# Altium schematic sheet Adapters.SchDoc: various
size 420 x 297 mm; Author: G.Kasprowicz; CompanyName: WUT ISE; DrawnBy: G.Kasprowicz; Organization: WUT ISE; Address1: PW ISE; Address2: Nowowiejska 15/19 00-665 Warsaw; Address3: gkasprow@gmail.com; DocumentNumber: 4; Revision: 2; SheetNumber: 4; SheetTotal: 8; ModifiedBy: -; CheckedDate: -; Title2: adapters; DivGrp: WUT ISE; Designer: G.Kasprowicz; ModifiedDate: -; ProjectName: Sensor Box
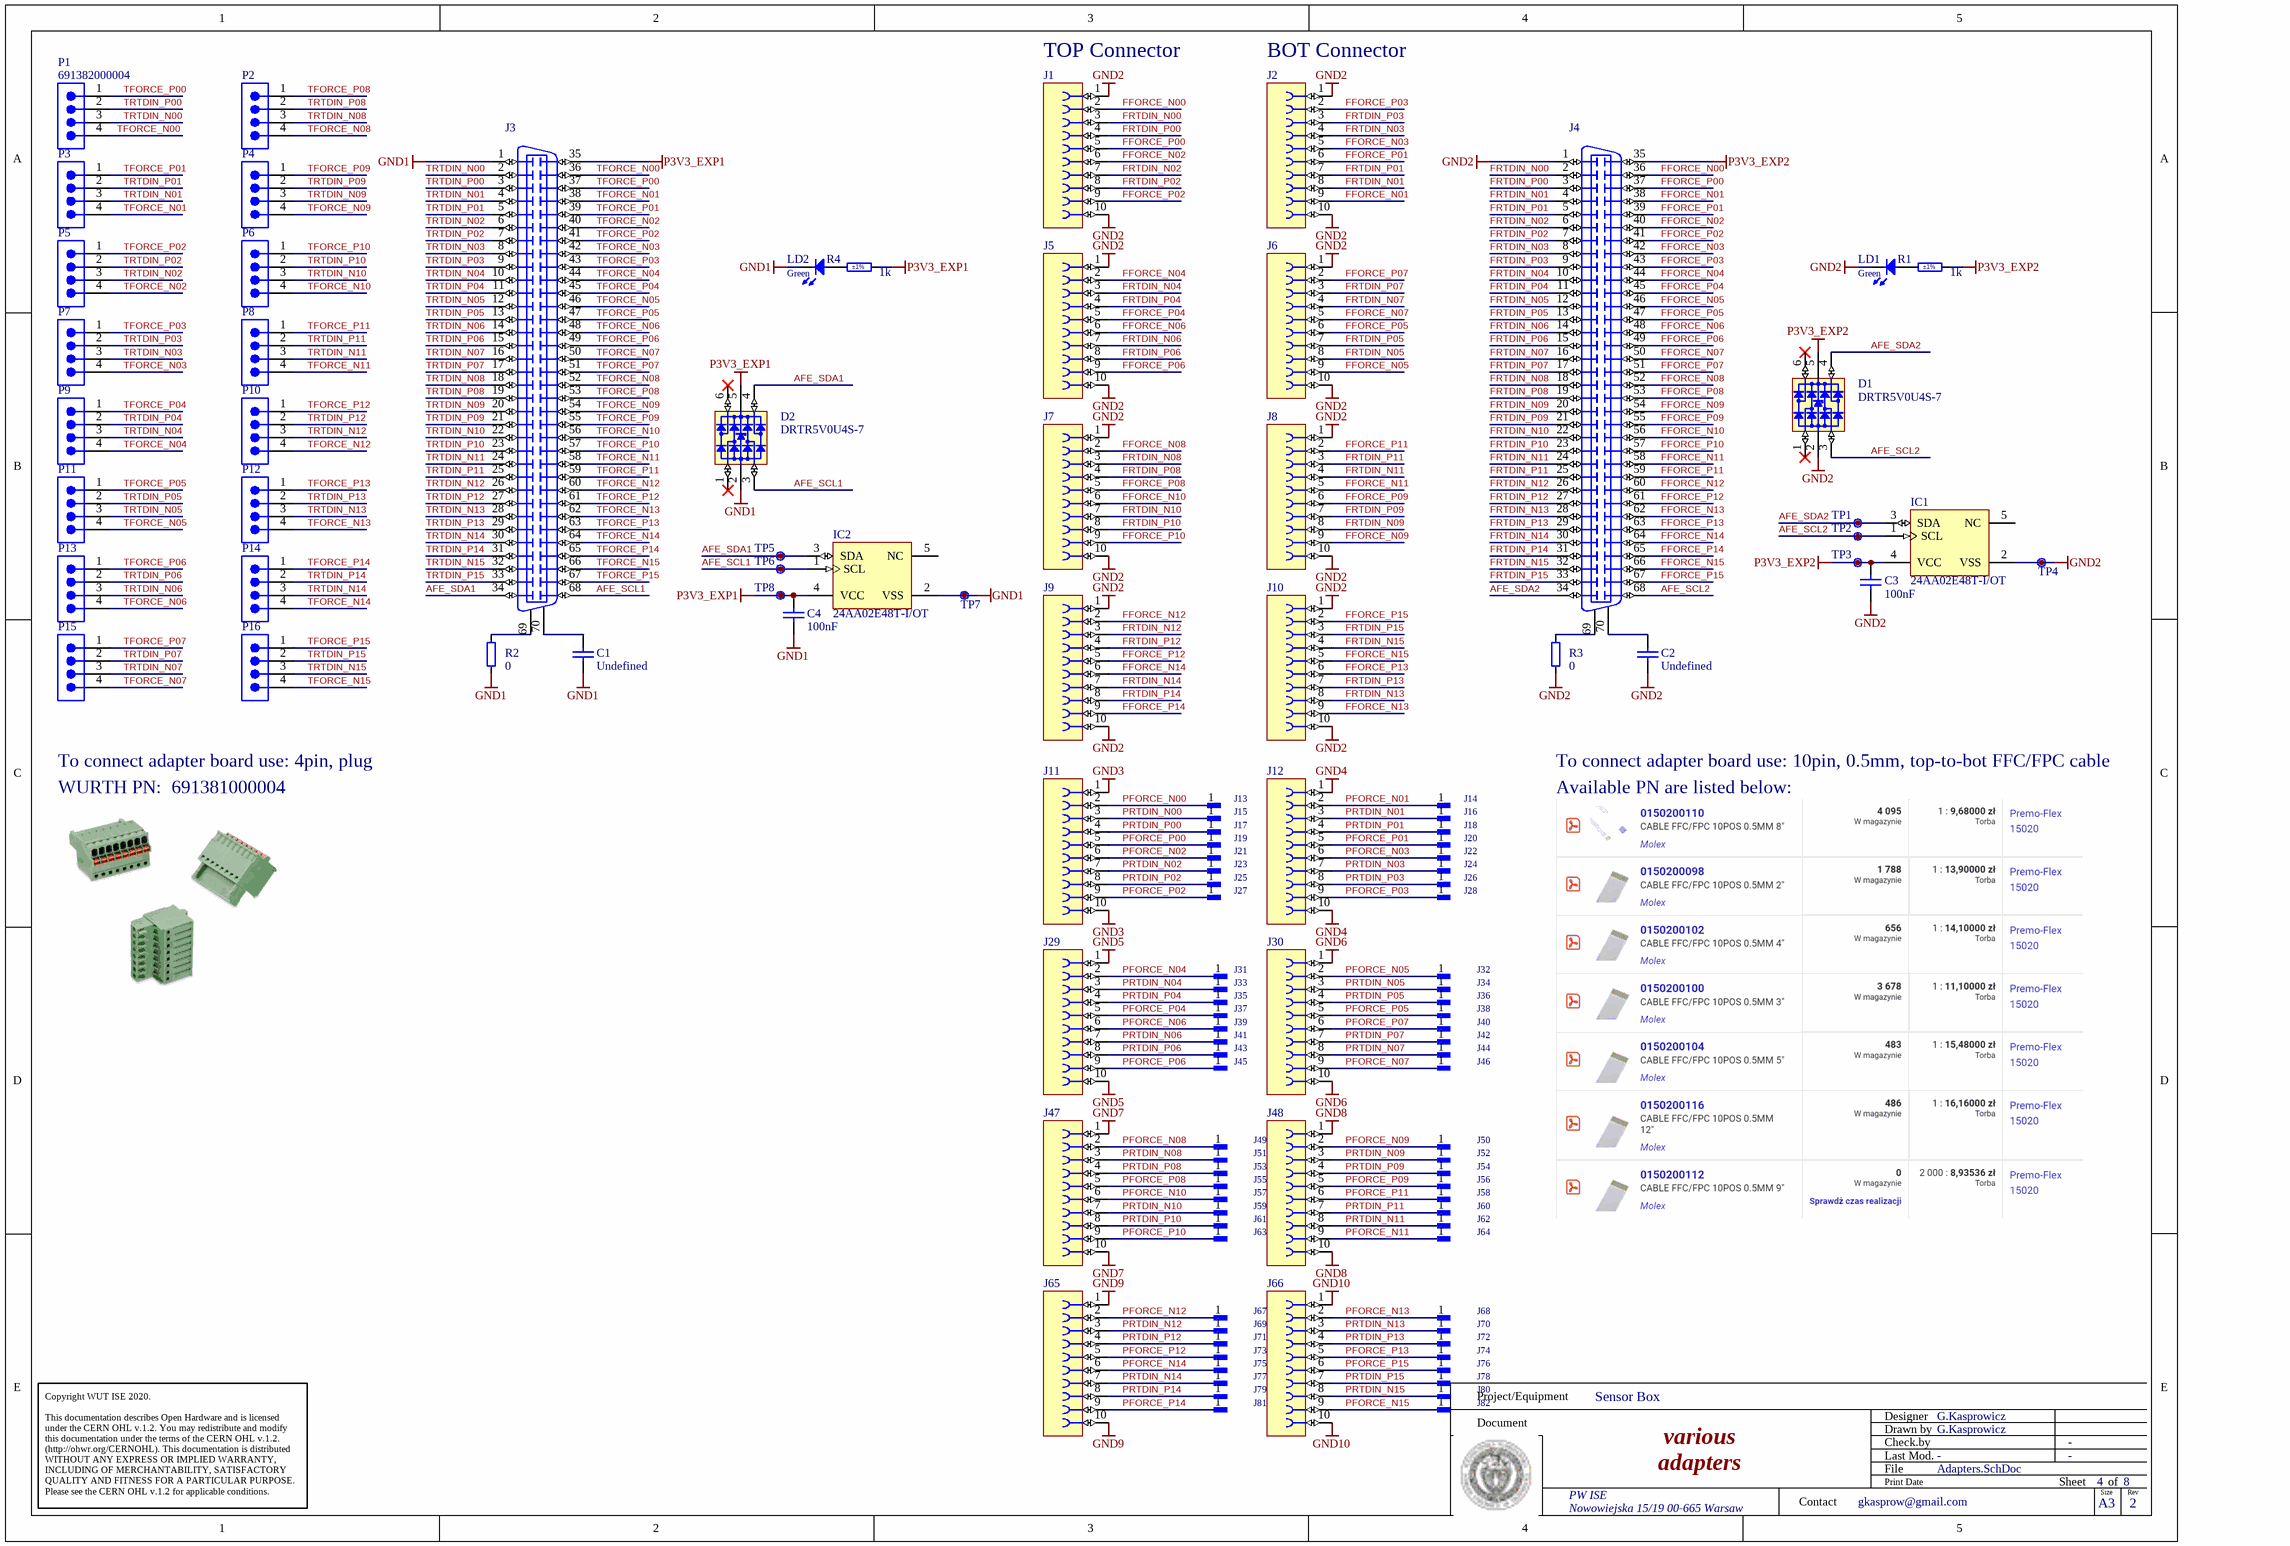
[diagram p0: Adapters.SchDoc]

## Parts
C1  Undefined  [CAPC2012X135N]
C2  Undefined  [CAPC2012X135N]
C3  100nF  [CAPC1608X87N]
C4  100nF  [CAPC1608X87N]
D1  DRTR5V0U4S-7  [SOT65P210X110-6N]
D2  DRTR5V0U4S-7  [SOT65P210X110-6N]
IC1  24AA02E48T-I/OT  [SOT95P280X145-5N]
IC2  24AA02E48T-I/OT  [SOT95P280X145-5N]
J1  FFC/FPC  [MOLEX_52745-1097]  (value not drawn)
J2  FFC/FPC  [MOLEX_52745-1097]  (value not drawn)
J3  DNP  [MOLEX_71430-0013]  (value not drawn)
J4  DNP  [MOLEX_71430-0013]  (value not drawn)
J5  FFC/FPC  [MOLEX_52745-1097]  (value not drawn)
J6  FFC/FPC  [MOLEX_52745-1097]  (value not drawn)
J7  FFC/FPC  [MOLEX_52745-1097]  (value not drawn)
J8  FFC/FPC  [MOLEX_52745-1097]  (value not drawn)
J9  FFC/FPC  [MOLEX_52745-1097]  (value not drawn)
J10  FFC/FPC  [MOLEX_52745-1097]  (value not drawn)
J11  FFC/FPC  [MOLEX_52745-1097]  (value not drawn)
J12  FFC/FPC  [MOLEX_52745-1097]  (value not drawn)
J13  SMD Pad  [R350X200]  (value not drawn)  (net tie, no BOM)
J14  SMD Pad  [R350X200]  (value not drawn)  (net tie, no BOM)
J15  SMD Pad  [R350X200]  (value not drawn)  (net tie, no BOM)
J16  SMD Pad  [R350X200]  (value not drawn)  (net tie, no BOM)
J17  SMD Pad  [R350X200]  (value not drawn)  (net tie, no BOM)
J18  SMD Pad  [R350X200]  (value not drawn)  (net tie, no BOM)
J19  SMD Pad  [R350X200]  (value not drawn)  (net tie, no BOM)
J20  SMD Pad  [R350X200]  (value not drawn)  (net tie, no BOM)
J21  SMD Pad  [R350X200]  (value not drawn)  (net tie, no BOM)
J22  SMD Pad  [R350X200]  (value not drawn)  (net tie, no BOM)
J23  SMD Pad  [R350X200]  (value not drawn)  (net tie, no BOM)
J24  SMD Pad  [R350X200]  (value not drawn)  (net tie, no BOM)
J25  SMD Pad  [R350X200]  (value not drawn)  (net tie, no BOM)
J26  SMD Pad  [R350X200]  (value not drawn)  (net tie, no BOM)
J27  SMD Pad  [R350X200]  (value not drawn)  (net tie, no BOM)
J28  SMD Pad  [R350X200]  (value not drawn)  (net tie, no BOM)
J29  FFC/FPC  [MOLEX_52745-1097]  (value not drawn)
J30  FFC/FPC  [MOLEX_52745-1097]  (value not drawn)
J31  SMD Pad  [R350X200]  (value not drawn)  (net tie, no BOM)
J32  SMD Pad  [R350X200]  (value not drawn)  (net tie, no BOM)
J33  SMD Pad  [R350X200]  (value not drawn)  (net tie, no BOM)
J34  SMD Pad  [R350X200]  (value not drawn)  (net tie, no BOM)
J35  SMD Pad  [R350X200]  (value not drawn)  (net tie, no BOM)
J36  SMD Pad  [R350X200]  (value not drawn)  (net tie, no BOM)
J37  SMD Pad  [R350X200]  (value not drawn)  (net tie, no BOM)
J38  SMD Pad  [R350X200]  (value not drawn)  (net tie, no BOM)
J39  SMD Pad  [R350X200]  (value not drawn)  (net tie, no BOM)
J40  SMD Pad  [R350X200]  (value not drawn)  (net tie, no BOM)
J41  SMD Pad  [R350X200]  (value not drawn)  (net tie, no BOM)
J42  SMD Pad  [R350X200]  (value not drawn)  (net tie, no BOM)
J43  SMD Pad  [R350X200]  (value not drawn)  (net tie, no BOM)
J44  SMD Pad  [R350X200]  (value not drawn)  (net tie, no BOM)
J45  SMD Pad  [R350X200]  (value not drawn)  (net tie, no BOM)
J46  SMD Pad  [R350X200]  (value not drawn)  (net tie, no BOM)
J47  FFC/FPC  [MOLEX_52745-1097]  (value not drawn)
J48  FFC/FPC  [MOLEX_52745-1097]  (value not drawn)
J49  SMD Pad  [R350X200]  (value not drawn)  (net tie, no BOM)
J50  SMD Pad  [R350X200]  (value not drawn)  (net tie, no BOM)
J51  SMD Pad  [R350X200]  (value not drawn)  (net tie, no BOM)
J52  SMD Pad  [R350X200]  (value not drawn)  (net tie, no BOM)
J53  SMD Pad  [R350X200]  (value not drawn)  (net tie, no BOM)
J54  SMD Pad  [R350X200]  (value not drawn)  (net tie, no BOM)
J55  SMD Pad  [R350X200]  (value not drawn)  (net tie, no BOM)
J56  SMD Pad  [R350X200]  (value not drawn)  (net tie, no BOM)
J57  SMD Pad  [R350X200]  (value not drawn)  (net tie, no BOM)
J58  SMD Pad  [R350X200]  (value not drawn)  (net tie, no BOM)
J59  SMD Pad  [R350X200]  (value not drawn)  (net tie, no BOM)
J60  SMD Pad  [R350X200]  (value not drawn)  (net tie, no BOM)
J61  SMD Pad  [R350X200]  (value not drawn)  (net tie, no BOM)
J62  SMD Pad  [R350X200]  (value not drawn)  (net tie, no BOM)
J63  SMD Pad  [R350X200]  (value not drawn)  (net tie, no BOM)
J64  SMD Pad  [R350X200]  (value not drawn)  (net tie, no BOM)
J65  FFC/FPC  [MOLEX_52745-1097]  (value not drawn)
J66  FFC/FPC  [MOLEX_52745-1097]  (value not drawn)
J67  SMD Pad  [R350X200]  (value not drawn)  (net tie, no BOM)
J68  SMD Pad  [R350X200]  (value not drawn)  (net tie, no BOM)
J69  SMD Pad  [R350X200]  (value not drawn)  (net tie, no BOM)
J70  SMD Pad  [R350X200]  (value not drawn)  (net tie, no BOM)
J71  SMD Pad  [R350X200]  (value not drawn)  (net tie, no BOM)
J72  SMD Pad  [R350X200]  (value not drawn)  (net tie, no BOM)
J73  SMD Pad  [R350X200]  (value not drawn)  (net tie, no BOM)
J74  SMD Pad  [R350X200]  (value not drawn)  (net tie, no BOM)
J75  SMD Pad  [R350X200]  (value not drawn)  (net tie, no BOM)
J76  SMD Pad  [R350X200]  (value not drawn)  (net tie, no BOM)
J77  SMD Pad  [R350X200]  (value not drawn)  (net tie, no BOM)
J78  SMD Pad  [R350X200]  (value not drawn)  (net tie, no BOM)
J79  SMD Pad  [R350X200]  (value not drawn)  (net tie, no BOM)
J80  SMD Pad  [R350X200]  (value not drawn)  (net tie, no BOM)
J81  SMD Pad  [R350X200]  (value not drawn)  (net tie, no BOM)
J82  SMD Pad  [R350X200]  (value not drawn)  (net tie, no BOM)
LD1  Green  [LED_KINGBRIGHT_KPH-1608CGCK]
LD2  Green  [LED_KINGBRIGHT_KPH-1608CGCK]
P1  691382000004  [691382000004]
P2  691382000004  [691382000004]  (value not drawn)
P3  691382000004  [691382000004]  (value not drawn)
P4  691382000004  [691382000004]  (value not drawn)
P5  691382000004  [691382000004]  (value not drawn)
P6  691382000004  [691382000004]  (value not drawn)
P7  691382000004  [691382000004]  (value not drawn)
P8  691382000004  [691382000004]  (value not drawn)
P9  691382000004  [691382000004]  (value not drawn)
P10  691382000004  [691382000004]  (value not drawn)
P11  691382000004  [691382000004]  (value not drawn)
P12  691382000004  [691382000004]  (value not drawn)
P13  691382000004  [691382000004]  (value not drawn)
P14  691382000004  [691382000004]  (value not drawn)
P15  691382000004  [691382000004]  (value not drawn)
P16  691382000004  [691382000004]  (value not drawn)
R1  1k  Tolerance: ±1%  [RESC1608X55N]
R2  0  [RESC1608X55N]
R3  0  [RESC1608X55N]
R4  1k  Tolerance: ±1%  [RESC1608X55N]
TP1  Test Point  [TPS127]  (value not drawn)  (net tie, no BOM)
TP2  Test Point  [TPS127]  (value not drawn)  (net tie, no BOM)
TP3  Test Point  [TPS127]  (value not drawn)  (net tie, no BOM)
TP4  Test Point  [TPS127]  (value not drawn)  (net tie, no BOM)
TP5  Test Point  [TPS127]  (value not drawn)  (net tie, no BOM)
TP6  Test Point  [TPS127]  (value not drawn)  (net tie, no BOM)
TP7  Test Point  [TPS127]  (value not drawn)  (net tie, no BOM)
TP8  Test Point  [TPS127]  (value not drawn)  (net tie, no BOM)

## Nets
GND1: C1.1 C4.1 D2.2(GND) IC2.2(VSS) J3.1 LD2.1(C) R2.2 TP7.1
GND2: C2.1 C3.1 D1.2(GND) IC1.2(VSS) J1.1 J1.10 J2.1 J2.10 J4.1 J5.1 J5.10 J6.1 J6.10 J7.1 J7.10 J8.1 J8.10 J9.1 J9.10 J10.1 J10.10 LD1.1(C) R3.2 TP4.1
GND3: J11.1 J11.10
GND4: J12.1 J12.10
GND5: J29.1 J29.10
GND6: J30.1 J30.10
GND7: J47.1 J47.10
GND8: J48.1 J48.10
GND9: J65.1 J65.10
GND10: J66.1 J66.10
P3V3_EXP1: C4.2 D2.5(VBUS) IC2.4(VCC) J3.35 R4.2 TP8.1
P3V3_EXP2: C3.2 D1.5(VBUS) IC1.4(VCC) J4.35 R1.2 TP3.1
AFE_SCL1: D2.3(I/O2) IC2.1(SCL) J3.68 TP6.1
AFE_SCL2: D1.3(I/O2) IC1.1(SCL) J4.68 TP2.1
AFE_SDA1: D2.4(I/O3) IC2.3(SDA) J3.34 TP5.1
AFE_SDA2: D1.4(I/O3) IC1.3(SDA) J4.34 TP1.1
FFORCE_N00: J1.2 J4.36
FFORCE_N01: J2.9 J4.38
FFORCE_N02: J1.6 J4.40
FFORCE_N03: J2.5 J4.42
FFORCE_N04: J4.44 J5.2
FFORCE_N05: J4.46 J6.9
FFORCE_N06: J4.48 J5.6
FFORCE_N07: J4.50 J6.5
FFORCE_N08: J4.52 J7.2
FFORCE_N09: J4.54 J8.9
FFORCE_N10: J4.56 J7.6
FFORCE_N11: J4.58 J8.5
FFORCE_N12: J4.60 J9.2
FFORCE_N13: J4.62 J10.9
FFORCE_N14: J4.64 J9.6
FFORCE_N15: J4.66 J10.5
FFORCE_P00: J1.5 J4.37
FFORCE_P01: J2.6 J4.39
FFORCE_P02: J1.9 J4.41
FFORCE_P03: J2.2 J4.43
FFORCE_P04: J4.45 J5.5
FFORCE_P05: J4.47 J6.6
FFORCE_P06: J4.49 J5.9
FFORCE_P07: J4.51 J6.2
FFORCE_P08: J4.53 J7.5
FFORCE_P09: J4.55 J8.6
FFORCE_P10: J4.57 J7.9
FFORCE_P11: J4.59 J8.2
FFORCE_P12: J4.61 J9.5
FFORCE_P13: J4.63 J10.6
FFORCE_P14: J4.65 J9.9
FFORCE_P15: J4.67 J10.2
FRTDIN_N00: J1.3 J4.2
FRTDIN_N01: J2.8 J4.4
FRTDIN_N02: J1.7 J4.6
FRTDIN_N03: J2.4 J4.8
FRTDIN_N04: J4.10 J5.3
FRTDIN_N05: J4.12 J6.8
FRTDIN_N06: J4.14 J5.7
FRTDIN_N07: J4.16 J6.4
FRTDIN_N08: J4.18 J7.3
FRTDIN_N09: J4.20 J8.8
FRTDIN_N10: J4.22 J7.7
FRTDIN_N11: J4.24 J8.4
FRTDIN_N12: J4.26 J9.3
FRTDIN_N13: J4.28 J10.8
FRTDIN_N14: J4.30 J9.7
FRTDIN_N15: J4.32 J10.4
FRTDIN_P00: J1.4 J4.3
FRTDIN_P01: J2.7 J4.5
FRTDIN_P02: J1.8 J4.7
FRTDIN_P03: J2.3 J4.9
FRTDIN_P04: J4.11 J5.4
FRTDIN_P05: J4.13 J6.7
FRTDIN_P06: J4.15 J5.8
FRTDIN_P07: J4.17 J6.3
FRTDIN_P08: J4.19 J7.4
FRTDIN_P09: J4.21 J8.7
FRTDIN_P10: J4.23 J7.8
FRTDIN_P11: J4.25 J8.3
FRTDIN_P12: J4.27 J9.4
FRTDIN_P13: J4.29 J10.7
FRTDIN_P14: J4.31 J9.8
FRTDIN_P15: J4.33 J10.3
PFORCE_N00: J11.2 J13.1
PFORCE_N01: J12.2 J14.1
PFORCE_N02: J11.6 J21.1
PFORCE_N03: J12.6 J22.1
PFORCE_N04: J29.2 J31.1
PFORCE_N05: J30.2 J32.1
PFORCE_N06: J29.6 J39.1
PFORCE_N07: J30.9 J46.1
PFORCE_N08: J47.2 J49.1
PFORCE_N09: J48.2 J50.1
PFORCE_N10: J47.6 J57.1
PFORCE_N11: J48.9 J64.1
PFORCE_N12: J65.2 J67.1
PFORCE_N13: J66.2 J68.1
PFORCE_N14: J65.6 J75.1
PFORCE_N15: J66.9 J82.1
PFORCE_P00: J11.5 J19.1
PFORCE_P01: J12.5 J20.1
PFORCE_P02: J11.9 J27.1
PFORCE_P03: J12.9 J28.1
PFORCE_P04: J29.5 J37.1
PFORCE_P05: J30.5 J38.1
PFORCE_P06: J29.9 J45.1
PFORCE_P07: J30.6 J40.1
PFORCE_P08: J47.5 J55.1
PFORCE_P09: J48.5 J56.1
PFORCE_P10: J47.9 J63.1
PFORCE_P11: J48.6 J58.1
PFORCE_P12: J65.5 J73.1
PFORCE_P13: J66.5 J74.1
PFORCE_P14: J65.9 J81.1
PFORCE_P15: J66.6 J76.1
PRTDIN_N00: J11.3 J15.1
PRTDIN_N01: J12.3 J16.1
PRTDIN_N02: J11.7 J23.1
PRTDIN_N03: J12.7 J24.1
PRTDIN_N04: J29.3 J33.1
PRTDIN_N05: J30.3 J34.1
PRTDIN_N06: J29.7 J41.1
PRTDIN_N07: J30.8 J44.1
PRTDIN_N08: J47.3 J51.1
PRTDIN_N09: J48.3 J52.1
PRTDIN_N10: J47.7 J59.1
PRTDIN_N11: J48.8 J62.1
PRTDIN_N12: J65.3 J69.1
PRTDIN_N13: J66.3 J70.1
PRTDIN_N14: J65.7 J77.1
PRTDIN_N15: J66.8 J80.1
PRTDIN_P00: J11.4 J17.1
PRTDIN_P01: J12.4 J18.1
PRTDIN_P02: J11.8 J25.1
PRTDIN_P03: J12.8 J26.1
PRTDIN_P04: J29.4 J35.1
PRTDIN_P05: J30.4 J36.1
PRTDIN_P06: J29.8 J43.1
PRTDIN_P07: J30.7 J42.1
PRTDIN_P08: J47.4 J53.1
PRTDIN_P09: J48.4 J54.1
PRTDIN_P10: J47.8 J61.1
PRTDIN_P11: J48.7 J60.1
PRTDIN_P12: J65.4 J71.1
PRTDIN_P13: J66.4 J72.1
PRTDIN_P14: J65.8 J79.1
PRTDIN_P15: J66.7 J78.1
TFORCE_N00: J3.36 P1.4
TFORCE_N01: J3.38 P3.4
TFORCE_N02: J3.40 P5.4
TFORCE_N03: J3.42 P7.4
TFORCE_N04: J3.44 P9.4
TFORCE_N05: J3.46 P11.4
TFORCE_N06: J3.48 P13.4
TFORCE_N07: J3.50 P15.4
TFORCE_N08: J3.52 P2.4
TFORCE_N09: J3.54 P4.4
TFORCE_N10: J3.56 P6.4
TFORCE_N11: J3.58 P8.4
TFORCE_N12: J3.60 P10.4
TFORCE_N13: J3.62 P12.4
TFORCE_N14: J3.64 P14.4
TFORCE_N15: J3.66 P16.4
TFORCE_P00: J3.37 P1.1
TFORCE_P01: J3.39 P3.1
TFORCE_P02: J3.41 P5.1
TFORCE_P03: J3.43 P7.1
TFORCE_P04: J3.45 P9.1
TFORCE_P05: J3.47 P11.1
TFORCE_P06: J3.49 P13.1
TFORCE_P07: J3.51 P15.1
TFORCE_P08: J3.53 P2.1
TFORCE_P09: J3.55 P4.1
TFORCE_P10: J3.57 P6.1
TFORCE_P11: J3.59 P8.1
TFORCE_P12: J3.61 P10.1
TFORCE_P13: J3.63 P12.1
TFORCE_P14: J3.65 P14.1
TFORCE_P15: J3.67 P16.1
TRTDIN_N00: J3.2 P1.3
TRTDIN_N01: J3.4 P3.3
TRTDIN_N02: J3.6 P5.3
TRTDIN_N03: J3.8 P7.3
TRTDIN_N04: J3.10 P9.3
TRTDIN_N05: J3.12 P11.3
TRTDIN_N06: J3.14 P13.3
TRTDIN_N07: J3.16 P15.3
TRTDIN_N08: J3.18 P2.3
TRTDIN_N09: J3.20 P4.3
TRTDIN_N10: J3.22 P6.3
TRTDIN_N11: J3.24 P8.3
TRTDIN_N12: J3.26 P10.3
TRTDIN_N13: J3.28 P12.3
TRTDIN_N14: J3.30 P14.3
TRTDIN_N15: J3.32 P16.3
TRTDIN_P00: J3.3 P1.2
TRTDIN_P01: J3.5 P3.2
TRTDIN_P02: J3.7 P5.2
TRTDIN_P03: J3.9 P7.2
TRTDIN_P04: J3.11 P9.2
TRTDIN_P05: J3.13 P11.2
TRTDIN_P06: J3.15 P13.2
TRTDIN_P07: J3.17 P15.2
TRTDIN_P08: J3.19 P2.2
TRTDIN_P09: J3.21 P4.2
TRTDIN_P10: J3.23 P6.2
TRTDIN_P11: J3.25 P8.2
TRTDIN_P12: J3.27 P10.2
TRTDIN_P13: J3.29 P12.2
TRTDIN_P14: J3.31 P14.2
TRTDIN_P15: J3.33 P16.2
NetC1_2: C1.2 J3.70
NetC2_2: C2.2 J4.70
NetJ3_69: J3.69 R2.1
NetJ4_69: J4.69 R3.1
NetLD1_2: LD1.2(A) R1.1
NetLD2_2: LD2.2(A) R4.1

Not connected (* = marked no-connect by the designer): D1 1(I/O1)* 6(I/O4)*; D2 1(I/O1)* 6(I/O4)*; IC1 5(NC); IC2 5(NC)

## Notes on the sheet
- (near J1) TOP Connector
- (near J2) BOT Connector
- To connect adapter board use: 4pin, plug
- To connect adapter board use: 10pin, 0.5mm, top-to-bot FFC/FPC cable
- WURTH PN:  691381000004
- Available PN are listed below:
- Project/Equipment
- Document
- Designer
- Drawn by
- Check.by
- Copyright WUT ISE 2020.
  This documentation describes Open Hardware and is licensed under the CERN OHL v.1.2. You may redistribute and modify this documentation under the terms of the CERN OHL v.1.2. (http://ohwr.org/CERNOHL). This documentation is distributed WITHOUT ANY EXPRESS OR IMPLIED WARRANTY, INCLUDING OF MERCHANTABILITY, SATISFACTORY QUALITY AND FITNESS FOR A PARTICULAR PURPOSE. Please see the CERN OHL v.1.2 for applicable conditions.
- Contact
- File
- Last Mod.
- Print Date
- Sheet
- Size
- A3
- of
- Rev

## Library data of the parts
C1 C2 = CC0805_NO-VALUE: Non-polarised capacitor; Part Description: Reserved Footprint For 0805(2012) Chip Ceramic Capacitor; Mounted: No; Part Number: CC0805_NO-VALUE; Component Kind: Standard; Component Type: Standard; Pin Count: 2; Value: Undefined; Status: None; Manufacturer: Undefined; Manufacturer Part Number: CC0805_NO-VALUE; Case: 0805; Socket: No; SMD: Yes; Sense: No; Manufacturer1 ComponentHeight: 1.35mm; HelpURL: Undefined; Author: CERN DEM JLC; CreateDate: 10.12.2008; LatestRevisionDate: 11.09.2013
C3 C4 = CC0603_100NF_50V_10%_X7R: Non-polarised capacitor; Part Description: SMD Multilayer Chip Ceramic Capacitor; Manufacturer: GENERIC; Manufacturer1 Part Number: 223858615649; Voltage: 50V; TC: X7R; Tolerance: ±10%; Part Number: CC0603_100NF_50V_10%_X7R; Component Kind: Standard; Component Type: Standard; Pin Count: 2; Value: 100nF; Status: Preferred; Manufacturer Part Number: CC0603_100NF_50V_10%_X7R; Case: 0603; Mounted: Yes; Socket: No; SMD: Yes; Sense: No; Manufacturer1 Example: PHYCOMP; Manufacturer1 ComponentHeight: 0.87mm; HelpURL: \\cern.ch\dfs\Applications\Altium\Datasheets\CC0603_X7R_PHYCOMP.pdf; Author: CERN DEM JLC; CreateDate: 03.12.2007; LatestRevisionDate: 03.12.2007
D1 D2 = D_TVS_DRTR5V0U4S-7: Integrated Quad Ultra-Low Capacitance ESD Protection; Part Description: Integrated Quad Ultra-Low Capacitance ESD (±8kV) Protection; Manufacturer: DIODES; PressFit: No; Bonding: No; Status Comment: Active; Part Number: DRTR5V0U4S-7; Component Kind: Standard; Component Type: Standard; Device: DRTR5V0U4S-7; PackageDescription: SOT363, SC70-6, 0.65mm Pitch; 6 Pin, 1.25mm W X 2.00mm L X 1.10mm H body, IPC Medium Density; Status: Active; Manufacturer Part Number: DRTR5V0U4S-7; Pin Count: 6; Case: SOT363; Mounted: Yes; Socket: No; SMD: Yes; Sense: No; ComponentHeight: 1.1mm; HelpURL: \\cern.ch\dfs\Applications\Altium\Datasheets\PRTR5V0U4Y.pdf; Author: GK; CreateDate: 24.01.2017; LatestRevisionDate: 14.09.2020
IC1 IC2 = 24AA02E48T-I/OT: 1.7V-5.5V, 2K I2C Serial EEPROM With EUI-48 Node Identity; Manufacturer: MICROCHIP TECHNOLOGY; PressFit: No; Bonding: No; Part Number: 24AA02E48T-I/OT; Component Kind: Standard; Component Type: Standard; Device: 24AA02E48T-I/OT; PackageDescription: SOT, 0.95mm pitch; 5 pin, 1.60mm W X 2.90mm L X 1.45mm H body, IPC Medium Density; Part Description: 1.7V-5.5V, 2K I2C Serial EEPROM with EUI-48 Node Identity; Manufacturer Part Number: 24AA02E48T-I/OT; Pin Count: 5; Case: SOT23-5; Mounted: Yes; Socket: No; SMD: Yes; Sense: No; ComponentHeight: 1.45mm; HelpURL: \\cern.ch\dfs\Applications\Altium\Datasheets\24AA02E48T-I-OT.pdf; Author: CERN DEM MR; CreateDate: 31.03.2016; LatestRevisionDate: 31.03.2016
J1 J2 J5-J12 J29 J30 J47 J48 J65 J66 = MOLEX_52745-1097: Connector 10 Female; Part Description: 10 Contacts, 0.5mm Pitch, Right Angled Surface Mount FFC/FPC Connector, ZIF, Top Contact Style; Manufacturer: MOLEX; PressFit: No; Part Number: MOLEX_52745-1097; Component Kind: Standard; Component Type: Standard; Pin Count: 10; Family: FFC/FPC; Mounted: Yes; Socket: No; SMD: Yes; Sense: No; Status: None; Manufacturer Part Number: 52745-1097; ComponentHeight: 2mm; HelpURL: \\cern.ch\dfs\Applications\Altium\Datasheets\MOLEX_52745-1097.pdf; Author: CERN DEM JLC; CreateDate: 04.11.2014; LatestRevisionDate: 05.12.2014
J3 J4 = MOLEX_71430-0013: Very High Density Cable Interconnect (VHDCI ) 68 Female; Part Description: 68 Positions, Pitch 0.8mm, Very Hight Density Right Angle Receptacle, VHDCI Standard (Recommended PCB Thickness: 1.6mm); Manufacturer: MOLEX; PressFit: No; Part Number: MOLEX_71430-0013; Component Kind: Standard; Component Type: Standard; Pin Count: 70; Family: VHDCI; Mounted: Yes; Socket: No; SMD: No; Status: None; Manufacturer Part Number: 71430-0013; ComponentHeight: 6.28mm; HelpURL: \\cern.ch\dfs\Applications\Altium\Datasheets\MOLEX_71430-0013.pdf; Author: CERN DEM JLC; CreateDate: 2014-01-30; LatestRevisionDate: 2014-01-30; Table: MOLEX
J13-J28 J31-J46 J49-J64 J67-J82 = SMD_PAD_3.5X2MM: Pad; Part Description: 3.5mm x 2mm SMD Pad; Mounted: No; Part Number: SMD_PAD_3.5X2MM; Component Type: Standard (No BOM); Pin Count: 1; Family: SMD Pad; Socket: No; SMD: Yes; Sense: No; Status: None; ComponentHeight: 0mm; HelpURL: Undefined; Author: CERN DEM JLC; CreateDate: 15.03.2010; LatestRevisionDate: 15.03.2010; PackageDescription: 3.5mm x  2mm SMD Pad
LD1 LD2 = LED_KINGBRIGHT_KPH-1608CGCK: LED Green 1C 2A; Part Description: SMD Green LED, Case 1.6mmX0.8mm(0603), 0.65mm Thickness; PressFit: No; Bonding: No; Part Number: LED_KINGBRIGHT_KPH-1608CGCK; Component Kind: Standard; Component Type: Standard; Color: Green; PackageDescription: SMT Green LED, Case 0603, Body L 1.6 x W 0.8mm H 0.65mm; Manufacturer: KINGBRIGHT; Manufacturer Part Number: KPH-1608CGCK; Pin Count: 2; Mounted: Yes; Socket: No; SMD: Yes; Sense: No; ComponentHeight: 0.65mm; HelpURL: \\cern.ch\dfs\Applications\Altium\Datasheets\LED_KINGBRIGHT_KPH-1608CGCK.pdf; Author: CERN DEM JLC; CreateDate: 03.07.2017; LatestRevisionDate: 03.07.2017; Case: 0603
P1-P16 = 691382000004: WR-TBL Series 382 Vertical PCB Header, THT, pitch 2.5mm, 4p; Manufacturer: Wurth Elektronik; Modularity: No; Rated Current: 4A; Working Voltage: 160V; ComponentLink1Description: Website Link; ComponentLink1URL: https://www.we-online.com/redexpert/article/691382000004?ad; ComponentLink2Description: Datasheet Link; ComponentLink2URL: https://www.we-online.com/redexpert/spec/691382000004?ad; Manufacturer Part Number: 691382000004; Category: Terminal Blocks; Match Code: WR-TBL; Mount: Through Hole; Operating Temperature Max: 105°C; Operating Temperature Min: -40°C; Packaging: Box; Application: Pluggable; Number of Pins: 4; Number of Rows: 1; Orientation: Vertical; Pitch: 2.5mm
R1 R4 = R0603_1K_1%_0.1W_100PPM: Resistor - 1%; Part Description: General Purpose Thick Film Chip Resistor; Manufacturer: GENERIC; Manufacturer1 Part Number: NRC06F1001TRF; Power: 0.1W; TC: ±100ppm/°C; PressFit: No; Part Number: R0603_1K_1%_0.1W_100PPM; Component Kind: Standard; Component Type: Standard; Pin Count: 2; Value: 1k; Status: Preferred; Manufacturer Part Number: R0603_1K_1%_0.1W_100PPM; Case: 0603; Mounted: Yes; Sense: No; Socket: No; SMD: Yes; Manufacturer1 Example: NIC COMPONENT; Manufacturer1 ComponentHeight: 0.55mm; HelpURL: \\cern.ch\dfs\Applications\Altium\Datasheets\R0603_NIC_NRC.pdf; Author: CERN DEM JLC; CreateDate: 03.12.2007; LatestRevisionDate: 13.03.2008
R2 R3 = R0603_0R_JUMPER: Resistor; Part Description: 1A (0.05R Max DC Resistance) Zero Ohm Jumper; Manufacturer: GENERIC; Manufacturer1 Part Number: NRC06Z0; PressFit: No; Part Number: R0603_0R_JUMPER; Component Kind: Standard; Component Type: Standard; Pin Count: 2; Value: 0; Status: Preferred; Manufacturer Part Number: R0603_0R_JUMPER; Case: 0603; Mounted: Yes; Sense: No; Socket: No; SMD: Yes; Manufacturer1 Example: NIC COMPONENT; Manufacturer1 ComponentHeight: 0.55mm; HelpURL: \\cern.ch\dfs\Applications\Altium\Datasheets\R0603_NIC_NRC.pdf; Author: CERN DEM JLC; CreateDate: 03.12.2007; LatestRevisionDate: 13.03.2008
TP1-TP8 = SMD_PAD_1.27X1.27MM: Part Description: 1.27mm x 1.27mm PCB Copper Area (SMD Test Point); Mounted: No; Part Number: SMD_PAD_1.27X1.27MM; Component Type: Standard (No BOM); Pin Count: 1; Family: Test Point; Socket: No; SMD: Yes; Sense: No; Status: None; ComponentHeight: 0mm; HelpURL: Undefined; Author: CERN DEM JLC; CreateDate: 12.01.2008; LatestRevisionDate: 12.01.2008; PackageDescription: 1.27mm x 1.27mm PCB Copper Area (SMD Test Point)